# Altium schematic sheet VIDEO_IN_TVP5150.SchDoc: Video Input
size A4; SheetNumber: 4; SheetTotal: 12
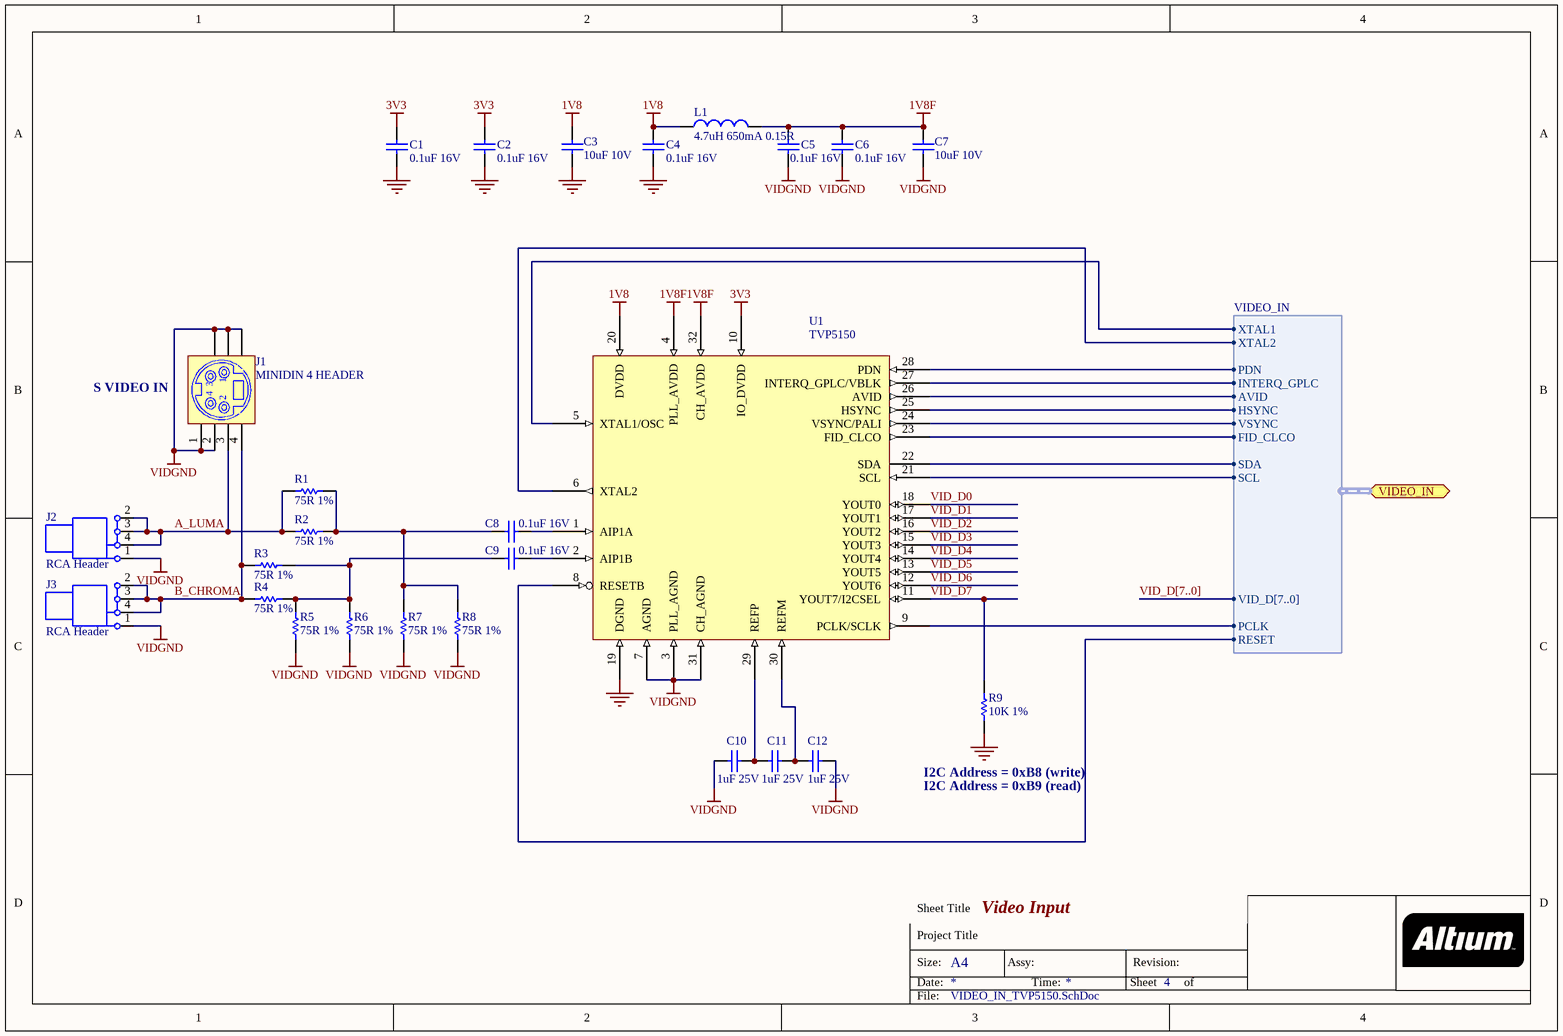
[diagram p0: VIDEO_IN_TVP5150.SchDoc]

## Parts
C1  0.1uF 16V  [CAPC1005-STAR]
C2  0.1uF 16V  [CAPC1005-STAR]
C3  10uF 10V  [CAPC2012-STAR]
C4  0.1uF 16V  [CAPC1005-STAR]
C5  0.1uF 16V  [CAPC1005-STAR]
C6  0.1uF 16V  [CAPC1005-STAR]
C7  10uF 10V  [CAPC2012-STAR]
C8  0.1uF 16V  [CAPC1005-STAR]
C9  0.1uF 16V  [CAPC1005-STAR]
C10  1uF 25V  [CAPC3216-STAR]
C11  1uF 25V  [CAPC3216-STAR]
C12  1uF 25V  [CAPC3216-STAR]
J1  MINIDIN 4 HEADER  [MDJ-F-04]
J2  RCA Header  [TRC-005]
J3  RCA Header  [TRC-005]
L1  4.7uH 650mA 0.15R  [INDC3225]
R1  75R 1%  [RESC1005-STAR]
R2  75R 1%  [RESC1005-STAR]
R3  75R 1%  [RESC1005-STAR]
R4  75R 1%  [RESC1005-STAR]
R5  75R 1%  [RESC1005-STAR]
R6  75R 1%  [RESC1005-STAR]
R7  75R 1%  [RESC1005-STAR]
R8  75R 1%  [RESC1005-STAR]
R9  10K 1%  [RESC1005-STAR]
U1  TVP5150  [TSQFP50P700X700-32]

## Ports
VIDEO_IN (harness VIDEO_IN)

## Harnesses
VIDEO_IN: INTERQ_GPLC, AVID, HSYNC, VSYNC, FID_CLCO, SCL, SDA, VID_D[7..0], PCLK, XTAL1, RESET, XTAL2, PDN

## Nets
1V8: C3.1 C4.2 L1.2 U1.20(DVDD)
1V8F: C5.2 C6.2 C7.1 L1.1 U1.4(PLL_AVDD) U1.32(CH_AVDD)
3V3: C1.2 C2.2 U1.10(IO_DVDD)
GND: C1.1 C2.1 C3.2 C4.1 R9.1 U1.19(DGND)
VIDGND: C5.1 C6.1 C7.2 C10.2 C12.1 J1.1(D) J1.2(A) J1.MH1 J1.MH2 J1.MH3 J2.1(Black) J3.1(Black) R5.1 R6.1 R7.1 R8.1 U1.3(PLL_AGND) U1.7(AGND) U1.31(CH_AGND)
A_LUMA: J1.3(H) J2.2(Yellow) J2.3(White) J2.4(Red) R1.2 R2.2
B_CHROMA: J1.4(E) J3.2(Yellow) J3.3(White) J3.4(Red) R3.2 R4.1
VID_D0: U1.18(YOUT0)
VID_D1: U1.17(YOUT1)
VID_D2: U1.16(YOUT2)
VID_D3: U1.15(YOUT3)
VID_D4: U1.14(YOUT4)
VID_D5: U1.13(YOUT5)
VID_D6: U1.12(YOUT6)
VID_D7: R9.2 U1.11(YOUT7/I2CSEL)
NetC8_1: C8.1 R1.1 R2.1 R7.2 R8.2
NetC8_2: C8.2 U1.1(AIP1A)
NetC9_1: C9.1 R3.1 R4.2 R5.2 R6.2
NetC9_2: C9.2 U1.2(AIP1B)
NetC10_1: C10.1 C11.2 U1.29(REFP)
NetC11_1: C11.1 C12.2 U1.30(REFM)
NetU1_5: U1.5(XTAL1/OSC) ; port VIDEO_IN.XTAL1
NetU1_6: U1.6(XTAL2) ; port VIDEO_IN.XTAL2
NetU1_8: U1.8(RESETB) ; port VIDEO_IN.RESET
NetU1_9: U1.9(PCLK/SCLK) ; port VIDEO_IN.PCLK
NetU1_21: U1.21(SCL) ; port VIDEO_IN.SCL
NetU1_22: U1.22(SDA) ; port VIDEO_IN.SDA
NetU1_23: U1.23(FID_CLCO) ; port VIDEO_IN.FID_CLCO
NetU1_24: U1.24(VSYNC/PALI) ; port VIDEO_IN.VSYNC
NetU1_25: U1.25(HSYNC) ; port VIDEO_IN.HSYNC
NetU1_26: U1.26(AVID) ; port VIDEO_IN.AVID
NetU1_27: U1.27(INTERQ_GPLC/VBLK) ; port VIDEO_IN.INTERQ_GPLC
NetU1_28: U1.28(PDN) ; port VIDEO_IN.PDN

## Buses and harness runs
bus VID_D[7..0]

## Notes on the sheet
- (near J1) S VIDEO IN
- (near R9) I2C Address = 0xB8 (write)
- I2C Address = 0xB9 (read)
- Sheet Title
- Project Title
- Size:
- Date:
- A4
- Assy:
- Time:
- Sheet
- Revision:
- of
- File:

## Library data of the parts
C1 C2 C4-C6 C8 C9 = D-101-0080: Capacitor, Ceramic, 0.1uF 10% 16V 0402 (1005) X7R; Polarity: Non-Polarized; Capacitance: 0.1 uF; Category: Capacitor; Dielectric: X7R; Mounting Technology: Surface Mount; Rated Voltage: 16 V; Status: Production; Technology: Ceramic; Tolerance: 10 %
C3 C7 = D-101-0087: Capacitor, Ceramic, 10uF 10% 10V 0805 (2012) X5R; Polarity: Non-Polarized; Capacitance: 10 uF; Category: Capacitor; Dielectric: X5R; Mounting Technology: Surface Mount; Rated Voltage: 10 V; Status: Unreleased; Technology: None; Tolerance: 10 %
C10-C12 = D-101-0027: Capacitor, Ceramic, 1uF 10% 25V 1206 (3216) X7R; Polarity: Polarized; Capacitance: 1 uF; Category: Capacitor; Dielectric: X7R; Mounting Technology: Surface Mount; Rated Voltage: 25 V; Status: Production; Technology: Ceramic; Tolerance: 10 %
J1 = D-300-0050: Connector, 4850.241, Mini-DIN 4-Way, S-Video/Yellow; Max Current: mA; Category: Connector; Connector type: Header; Mounting Technology: Through-Hole; Status: Unreleased
J2 J3 = D-300-0051: Connector, TRC-005-4 , RCA Phono Jack, Right Angle, Thru-Hole, Snap-In; Max Current: mA; Category: Connector; Connector type: Header; Mounting Technology: Through-Hole; Status: Unreleased
L1 = D-102-0005: Inductor, 4.7uH 650mA 0.15R 1210 (3225) LQH32CN4R7M11L; Category: Inductor; Status: Production
R1-R8 = D-100-0001: Resistor, 75R 1% 0402; Power Rating: mW; Resistance: mR; Category: Resistor; Mounting Technology: Surface Mount; Status: Production; Tolerance: 1 %
R9 = D-100-0130: Resistor, 10K 1% 0402 (1005); Power Rating: 63 mW; Category: Resistor; Mounting Technology: Surface Mount; Resistance: 10 K; Status: Production; Tolerance: 1 %
U1 = D-202-0000: TVP5150AM1PBS, Ultralow Power NTSC/PAL/SECAM Video Decoder With Robust Sync Detector; Category: IC-Video; Status: Production